# Altium schematic sheet voltmeter.SchDoc
size A4
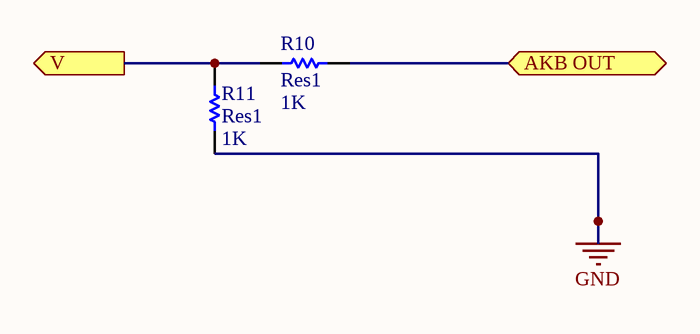
[diagram p0: voltmeter.SchDoc]

## Parts
R10  Res1  value 1K  [AXIAL-0.3]
R11  Res1  value 1K  [AXIAL-0.3]

## Ports
AKB OUT, V (out)

## Nets
GND: R11.1
AKB OUT: R10.2 ; port AKB OUT
V: R10.1 R11.2 ; port V

## Library data of the parts
R10 R11 = Res1: Resistor; Published: 8-Jun-2000; LatestRevisionDate: 17-Jul-2002; LatestRevisionNote: Re-released for DXP Platform.; PackageReference: AXIAL-0.3; Publisher: Altium Limited; PackageDescription: Axial Device, Thru-Hole; 2 Leads; 0.3 in Pin Spacing